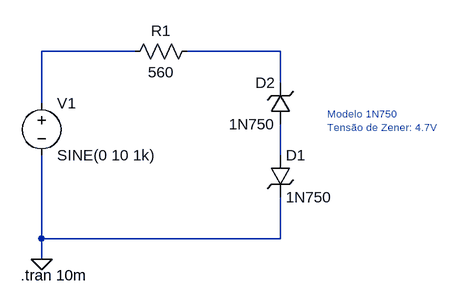
[diagram p0: schematic Limitador de Tensão com Diodo Zener.asc]
Limitador de Tensão com Diodo Zener.asc, the LTspice schematic file:
Version 4
SHEET 1 880 680
WIRE 128 64 -16 64
WIRE 352 64 208 64
WIRE 352 112 352 64
WIRE -16 144 -16 64
WIRE 352 224 352 176
WIRE -16 352 -16 224
WIRE 352 352 352 288
WIRE 352 352 -16 352
WIRE -16 384 -16 352
FLAG -16 384 0
SYMBOL zener 336 224 R0
SYMATTR InstName D1
SYMATTR Value 1N750
SYMBOL res 224 48 R90
WINDOW 0 0 56 VBottom 2
WINDOW 3 32 56 VTop 2
SYMATTR InstName R1
SYMATTR Value 560
SYMBOL zener 368 176 R180
WINDOW 0 24 64 Left 2
WINDOW 3 24 0 Left 2
SYMATTR InstName D2
SYMATTR Value 1N750
SYMBOL voltage -16 128 R0
WINDOW 123 0 0 Left 0
WINDOW 39 0 0 Left 0
SYMATTR InstName V1
SYMATTR Value SINE(0 10 1k)
TEXT -48 408 Left 2 !.tran 10m
TEXT 424 160 Left 1 ;Modelo 1N750\nTensão de Zener: 4.7V

The netlist it stands for:
* Limitador de Tensão com Diodo Zener.asc
D1 N003 0 1N750
R1 N002 N001 560
D2 N003 N002 1N750
V1 N001 0 SINE(0 10 1k)
.model D D
.lib standard.dio
.tran 10m
* Modelo 1N750
* Tensão de Zener: 4.7V
.backanno
.end